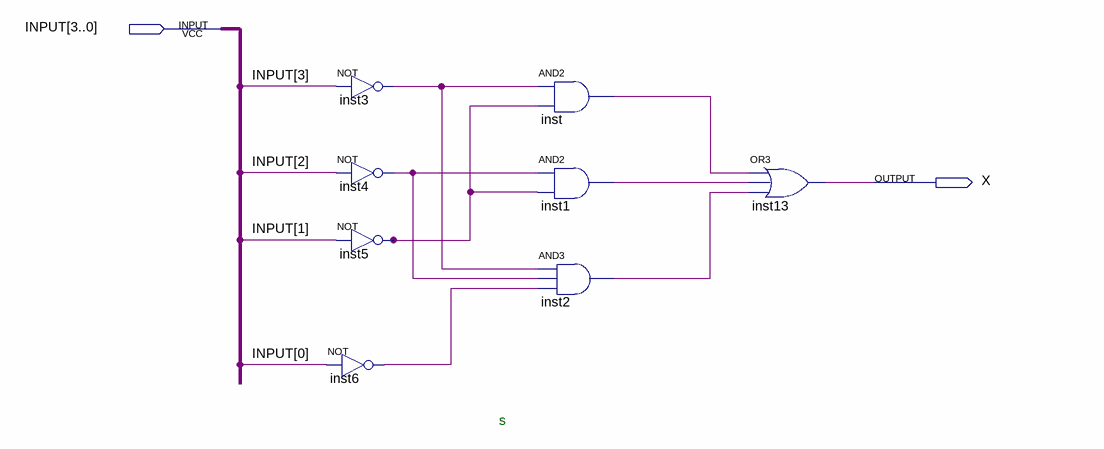
[diagram p0: schematic sheet]
// Quartus schematic ksy_ProjectPart1.bdf as structural Verilog: 8 symbols, 2 pins
module ksy_ProjectPart1 (
  input  [3:0] INPUT,
  output X
);

  wire inst1_out, inst2_out, inst3_out, inst4_out, inst5_out, inst6_out, inst_out;

  not inst3 (inst3_out, INPUT[3]);
  not inst4 (inst4_out, INPUT[2]);
  not inst5 (inst5_out, INPUT[1]);
  not inst6 (inst6_out, INPUT[0]);
  and inst (inst_out, inst3_out, inst5_out);
  and inst1 (inst1_out, inst4_out, inst5_out);
  and inst2 (inst2_out, inst3_out, inst4_out, inst6_out);
  or inst13 (X, inst_out, inst1_out, inst2_out);

  // Notes on the sheet:
  //   s
endmodule
